# Altium schematic sheet Sheet_1.schdoc
size 306 x 181 mm
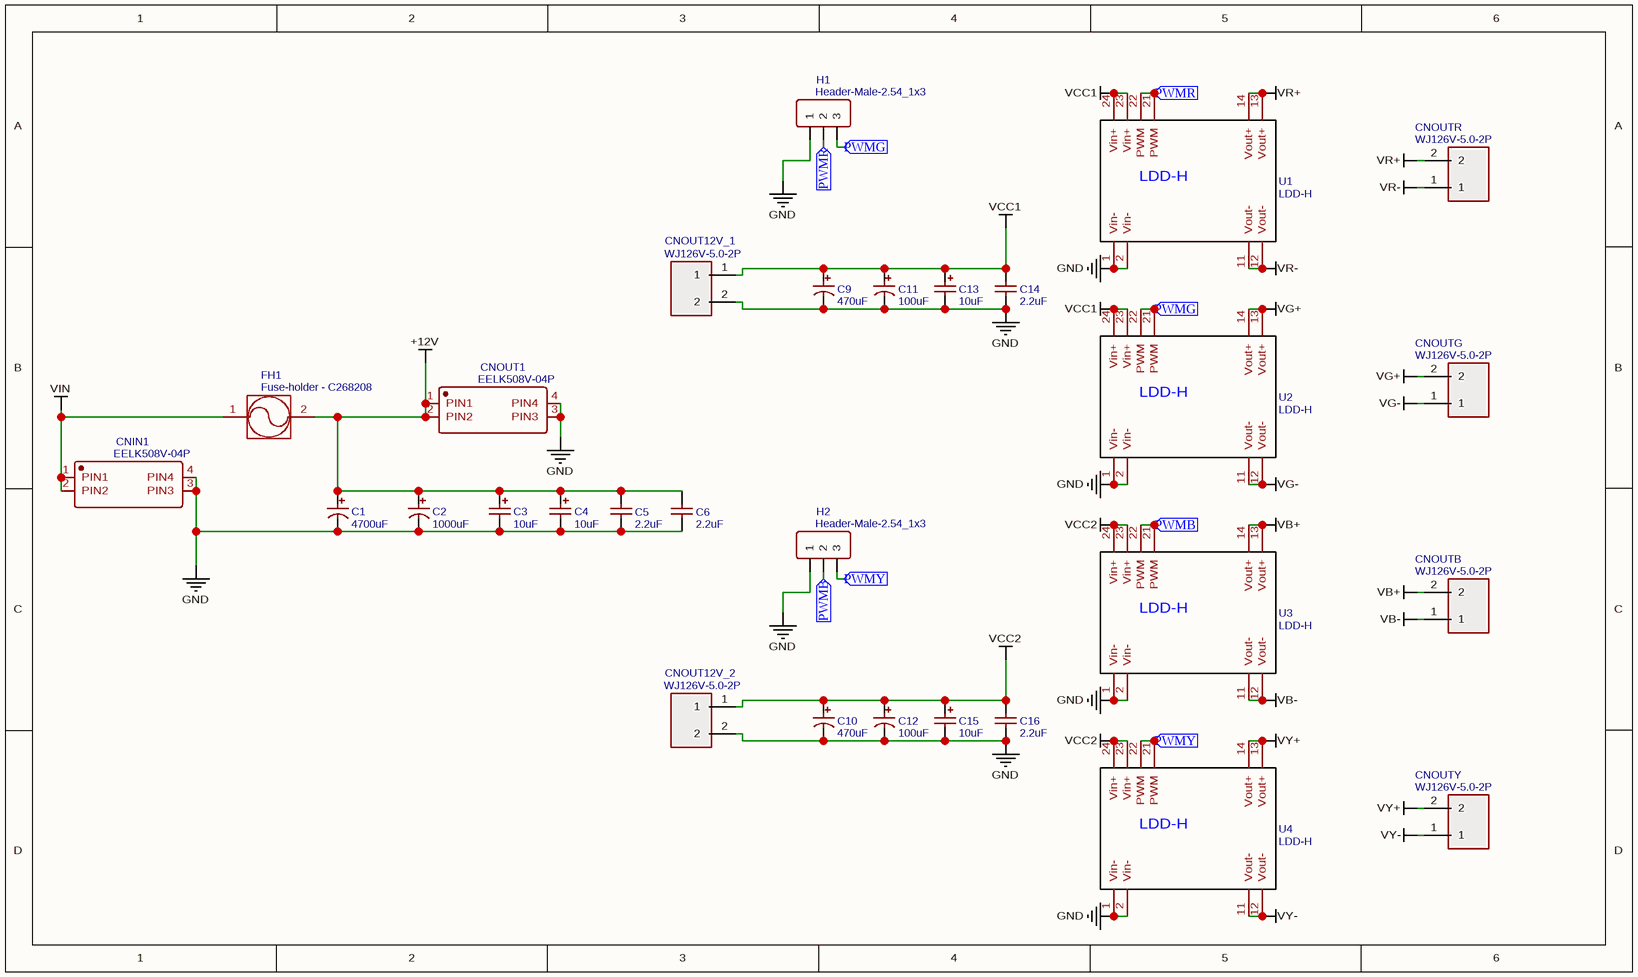
[diagram p0: Sheet_1.schdoc]

## Parts
C1  4700uF  [CAP-TH_BD16.0-P7.50-D1.2-FD]
C2  1000uF  [CAP-TH_BD10.0-P5.00-D1.0-FD]
C3  10uF  [CAP-TH_L15.5-W8.5-P7.50-D1.2]
C4  10uF  [CAP-TH_L15.5-W8.5-P7.50-D1.2]
C5  2.2uF  [CAP-0.2]
C6  2.2uF  [CAP-0.2]
C9  470uF  [CAP-TH_BD8.0-P3.50-D1.0-FD]
C10  470uF  [CAP-TH_BD8.0-P3.50-D1.0-FD]
C11  100uF  [CAP-TH_BD5.0-P2.00-D0.8-FD]
C12  100uF  [CAP-TH_BD5.0-P2.00-D0.8-FD]
C13  10uF  [CAP-TH_L15.5-W8.5-P7.50-D1.2]
C14  2.2uF  [CAP-0.2]
C15  10uF  [CAP-TH_L15.5-W8.5-P7.50-D1.2]
C16  2.2uF  [CAP-0.2]
CNIN1  EELK508V-04P  [EELK508V-04P]
CNOUT1  EELK508V-04P  [EELK508V-04P]
CNOUT12V_1  WJ126V-5.0-2P  [WJ126V-5.0-2P]
CNOUT12V_2  WJ126V-5.0-2P  [WJ126V-5.0-2P]
CNOUTB  WJ126V-5.0-2P  [WJ126V-5.0-2P]
CNOUTG  WJ126V-5.0-2P  [WJ126V-5.0-2P]
CNOUTR  WJ126V-5.0-2P  [WJ126V-5.0-2P]
CNOUTY  WJ126V-5.0-2P  [WJ126V-5.0-2P]
FH1  Fuse-holder - C268208  [FUSE-HOLDER- C268208]
H1  Header-Male-2.54_1x3  [HDR-TH_3P-P2.54-V]
H2  Header-Male-2.54_1x3  [HDR-TH_3P-P2.54-V]
U1  LDD-H  [LDD-H]
U2  LDD-H  [LDD-H]
U3  LDD-H  [LDD-H]
U4  LDD-H  [LDD-H]

## Ports
PWMB (in), PWMG (in), PWMR (in), PWMY (in)

## Nets
+12V: C1.1 C2.1 C3.1 C4.1 C5.1 C6.1 CNOUT1.1(PIN1) CNOUT1.2(PIN2) FH1.2
GND: C1.2 C2.2 C3.2 C4.2 C5.2 C6.2 C9.2 C10.2 C11.2 C12.2 C13.2 C14.2 C15.2 C16.2 CNIN1.3(PIN3) CNIN1.4(PIN4) CNOUT1.3(PIN3) CNOUT1.4(PIN4) CNOUT12V_1.2 CNOUT12V_2.2 H1.1 H2.1 U1.1(Vin-) U1.2(Vin-) U2.1(Vin-) U2.2(Vin-) U3.1(Vin-) U3.2(Vin-) U4.1(Vin-) U4.2(Vin-)
VB+: CNOUTB.2 U3.13(Vout+) U3.14(Vout+)
VB-: CNOUTB.1 U3.11(Vout-) U3.12(Vout-)
VCC1: C9.1 C11.1 C13.1 C14.1 CNOUT12V_1.1 U1.23(Vin+) U1.24(Vin+) U2.23(Vin+) U2.24(Vin+)
VCC2: C10.1 C12.1 C15.1 C16.1 CNOUT12V_2.1 U3.23(Vin+) U3.24(Vin+) U4.23(Vin+) U4.24(Vin+)
VG+: CNOUTG.2 U2.13(Vout+) U2.14(Vout+)
VG-: CNOUTG.1 U2.11(Vout-) U2.12(Vout-)
VIN: CNIN1.1(PIN1) CNIN1.2(PIN2) FH1.1
VR+: CNOUTR.2 U1.13(Vout+) U1.14(Vout+)
VR-: CNOUTR.1 U1.11(Vout-) U1.12(Vout-)
VY+: CNOUTY.2 U4.13(Vout+) U4.14(Vout+)
VY-: CNOUTY.1 U4.11(Vout-) U4.12(Vout-)
PWMB: H2.2 U3.21(PWM) U3.22(PWM) ; port PWMB
PWMG: H1.3 U2.21(PWM) U2.22(PWM) ; port PWMG
PWMR: H1.2 U1.21(PWM) U1.22(PWM) ; port PWMR
PWMY: H2.3 U4.21(PWM) U4.22(PWM) ; port PWMY

## Library data of the parts
C1 = 4700uF: BOM_Manufacturer: ValuePro; BOM_Manufacturer Part: 4700uF 25V 16*25V; nameAlias: Capacitance; BOM_Supplier: LCSC; BOM_Supplier Part: C45070; spicePre: C; spiceSymbolName: 4700uF 25V 16*25V
C2 = 1000uF: BOM_Manufacturer: ValuePro; BOM_Manufacturer Part: 1000uF 25V; nameAlias: Capacitance; BOM_Supplier: LCSC; BOM_Supplier Part: C10750; spicePre: C; spiceSymbolName: 1000uF 25V
C3 C4 C13 C15 = 10uF: BOM_Manufacturer: AVX; BOM_Manufacturer Part: TAP106K025SCS; nameAlias: Capacitance; BOM_Supplier: LCSC; BOM_Supplier Part: C28244; spicePre: C; spiceSymbolName: TAP106K025SCS
C5 C6 C14 C16 = 2.2uF: BOM_Manufacturer: Dersonic; BOM_Manufacturer Part: CD1E225KC9BER1E000; nameAlias: Capacitance; Contributor: LCSC; BOM_Supplier: LCSC; BOM_Supplier Part: C263178; spicePre: C; spiceSymbolName: CD1E225KC9BER1E000
C9 C10 = 470uF: BOM_Manufacturer: ValuePro; BOM_Manufacturer Part: 470uF 25V 8*12; nameAlias: Capacitance; BOM_Supplier: LCSC; BOM_Supplier Part: C43839; spicePre: C; spiceSymbolName: 470uF 25V 8*12
C11 C12 = 100uF: BOM_Manufacturer: ValuePro; BOM_Manufacturer Part: 100uF 25V 5*11; nameAlias: Capacitance; BOM_Supplier: LCSC; BOM_Supplier Part: C47873; spicePre: C; spiceSymbolName: 100uF 25V 5*11
CNIN1 CNOUT1 = EELK508V-04P: BOM_Manufacturer: Dinkle; Contributor: LCSC; BOM_Supplier: LCSC; BOM_Manufacturer Part: EELK508V-04P; BOM_Supplier Part: C99398; spicePre: C; spiceSymbolName: EELK508V-04P
CNOUT12V_1 CNOUT12V_2 CNOUTB CNOUTG CNOUTR CNOUTY = WJ126V-5.0-2P: BOM_Manufacturer: ReliaPro; BOM_Supplier: LCSC; BOM_Manufacturer Part: WJ126V-5.0-2P; image: //image.lceda.cn/szlcsc/C8404.jpg; BOM_Supplier Part: C8404; spicePre: P; spiceSymbolName: WJ126V-5.0-2P
FH1 = Fuse-holder - C268208: Contributor: AGRATX; BOM_Supplier Part: C268208; BOM_Supplier: LCSC; spicePre: U
H1 H2 = Header-Male-2.54_1x3: BOM_Manufacturer: BOOMELE; BOM_Manufacturer Part: Header2.54mm 1*3P; BOM_Supplier: LCSC; image: //image.lceda.cn/szlcsc/C49257.jpg; BOM_Supplier Part: C49257; spicePre: H; spiceSymbolName: Header-Male-2.54_1x3
U1-U4 = LDD-H: Contributor: rvaldepena; sourceId: IUcuoGYgy; timeStamp: 1473940377; spicePre: U; spiceSymbolName: LDD-H